# EAGLE design afb_r003 (EAGLE 9.6.2)
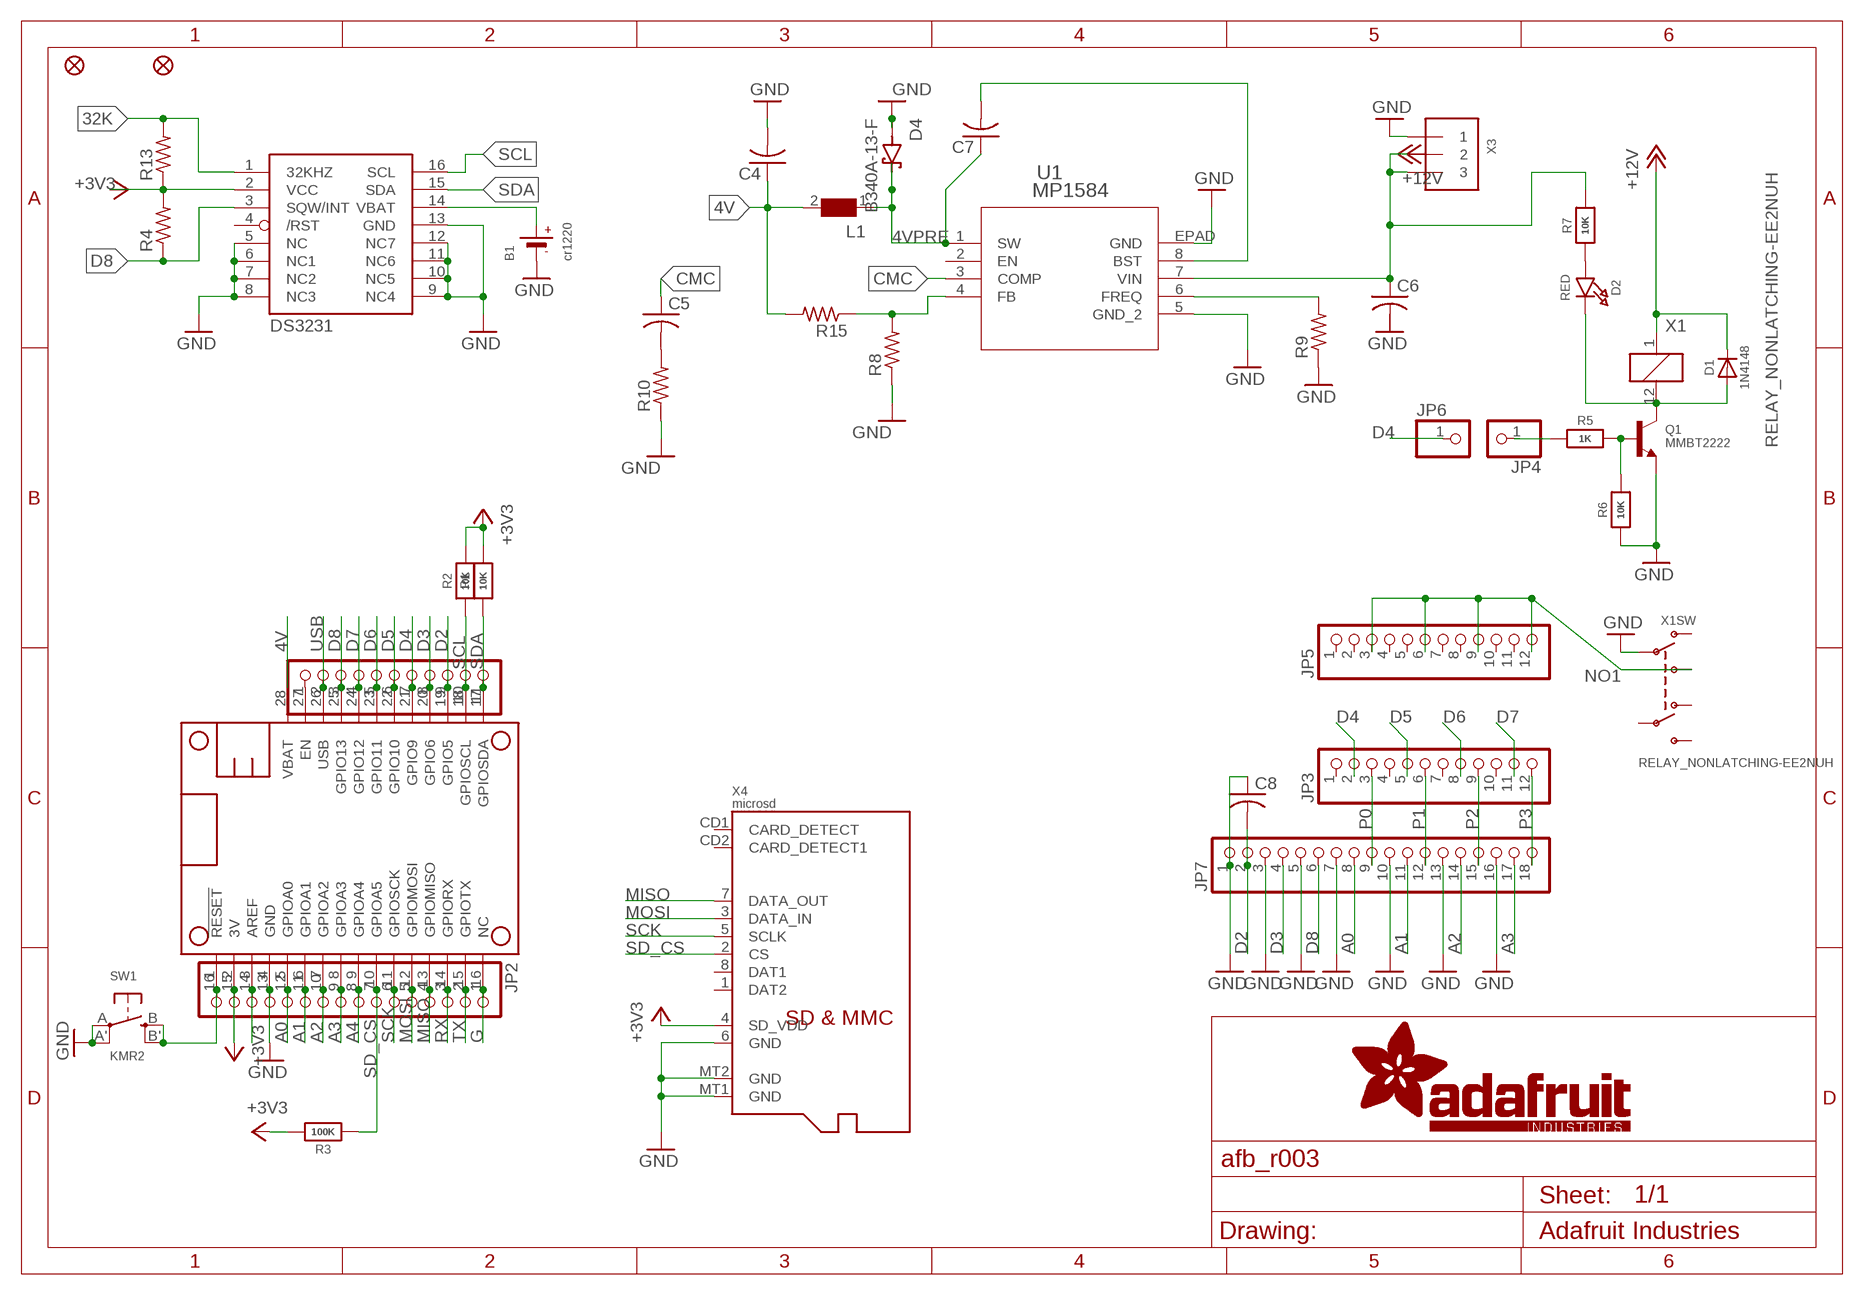
[diagram p0: schematic, sheet 1]

## Parts
B1  cr1220  BATTERYCR1220_2  [CR1220-2]
C4  C-USC0805  [C0805]
C5  C-USC0805  [C0805]
C6  C-USC0805  [C0805]
C7  C-USC0805  [C0805]
C8  C-USC0805  [C0805]
D1  1N4148  DIODESOD-323  [SOD-323]
D2  RED  LED0805_NOOUTLINE  [CHIPLED_0805_NOOUTLINE]
D4  B340A-13-F  [DIOM5226X240N]
FID1  FIDUCIAL_1MM  [FIDUCIAL_1MM]
FID2  FIDUCIAL_1MM  [FIDUCIAL_1MM]
IC2  DS3231/SO  [SO16W]
JP1  HEADER-1X11  [1X11_ROUND]
JP2  HEADER-1X16ROUND  [1X16_ROUND]
JP3  PINHD-1X12-CB  [1X12-CB]
JP4  HEADER-1X1ROUND  [1X01_ROUND]
JP5  PINHD-1X12-CB  [1X12-CB]
JP6  HEADER-1X1ROUND  [1X01_ROUND]
JP7  PINHD-1X18  [1X18]
L1  WE-PD-744771115_1260/1245/1280/1210  [WE-PD_1260/1245/1280/1210]
MS1  FEATHERWING_NODIM  [FEATHERWING_NODIM]
Q1  MMBT2222  TRANSISTOR_NPN  [SOT23-R]
R1  10K  RESISTOR_0603_NOOUT  [0603-NO]
R2  10K  RESISTOR_0603_NOOUT  [0603-NO]
R3  100K  RESISTOR_0603_NOOUT  [0603-NO]
R4  R-US_R0805  [R0805]
R5  1K  RESISTOR0805_NOOUTLINE  [0805-NO]
R6  10K  RESISTOR0805_NOOUTLINE  [0805-NO]
R7  10K  RESISTOR0805_NOOUTLINE  [0805-NO]
R8  R-US_R0805  [R0805]
R9  R-US_R0805  [R0805]
R10  R-US_R0805  [R0805]
R13  R-US_R0805  [R0805]
R15  R-US_R0805  [R0805]
SW1  KMR2  SWITCH_TACT_SMT4.6X2.8  [BTN_KMR2_4.6X2.8]
U1  MP1584  [SOIC8E_MPS]
X1  RELAY_NONLATCHING-EE2NUH  [RELAY_EE2_NOLATCH]
X3  TERMBLOCK_1X3  [TERMBLOCK_1X3-3.5MM]
X4  microsd  MICROSD  [MICROSD]

## Nets
4V: C4.1 L1.2 MS1.28(VBAT) R15.2
4VPRE: C7.1 D4.C L1.1 U1.1(SW)
32K: IC2.1(32KHZ) R13.2
+3V3: JP2.15 MS1.2(3V) R1.2 R2.2 R3.2 X4.4(SD_VDD)
+12V: D1.C X1.1
A0: JP2.12 JP7.8 MS1.5(GPIOA0)
A1: JP2.11 JP7.11 MS1.6(GPIOA1)
A2: JP2.10 JP7.14 MS1.7(GPIOA2)
A3: JP2.9 JP7.17 MS1.8(GPIOA3)
A4: JP2.8 MS1.9(GPIOA4)
AREF: JP2.14 MS1.3(AREF)
BSC: C7.2 U1.8(BST)
CMC: C5.1 U1.3(COMP)
D2: C8.2 JP1.9 JP7.2 MS1.19(GPIO5)
D3: JP1.8 JP7.4 MS1.20(GPIO6)
D4: JP1.7 JP3.2 JP6.1 MS1.21(GPIO9)
D5: JP1.6 JP3.5 MS1.22(GPIO10)
D6: JP1.5 JP3.8 MS1.23(GPIO11)
D7: JP1.4 JP3.11 MS1.24(GPIO12)
D8: IC2.2(VCC) JP1.3 JP7.6 MS1.25(GPIO13) R4.2 R13.1 ; supply symbol labelled +3V3
EN: JP1.1 MS1.27(EN)
G: JP2.1 MS1.16(NC)
GND: B1.- C4.2 C8.1 D4.A IC2.5(NC) IC2.6(NC1) IC2.7(NC2) IC2.8(NC3) IC2.9(NC4) IC2.10(NC5) IC2.11(NC6) IC2.12(NC7) IC2.13(GND) JP2.13 JP7.1 JP7.3 JP7.5 JP7.7 JP7.10 JP7.13 JP7.16 MS1.4(GND) Q1.2(E) R6.1 R8.1 R9.1 R10.1 SW1.A'(P1) SW1.A(P) U1.5(GND_2) U1.EPAD(GND) X1.9(SW:P1) X3.1 X4.6(GND) X4.MT1(GND) X4.MT2(GND)
MISO: JP2.4 MS1.13(GPIOMISO) X4.7(DATA_OUT)
MOSI: JP2.5 MS1.12(GPIOMOSI) X4.3(DATA_IN)
N$1: B1.+ IC2.14(VBAT)
N$2: D1.A D2.C Q1.3(C) X1.12
N$3: R8.2 R15.1 U1.4(FB)
N$4: C5.2 R10.2
N$5: C6.1 R7.2 U1.7(VIN) X3.2 X3.3
N$8: IC2.3(SQW/INT) R4.1
N$10: R9.2 U1.6(FREQ)
N$22: Q1.1(B) R5.2 R6.2
N$24: JP4.1 R5.1
N$26: D2.A R7.1
NO1 [HV]: JP5.3 JP5.6 JP5.9 JP5.12 X1.8(SW:S1)
P0: JP3.3 JP7.9
P1: JP3.6 JP7.12
P2: JP3.9 JP7.15
P3: JP3.12 JP7.18
RESET: JP2.16 MS1.1(!RESET) SW1.B'(S1) SW1.B(S)
RX: JP2.3 MS1.14(GPIORX)
SCK: JP2.6 MS1.11(GPIOSCK) X4.5(SCLK)
SCL: IC2.16(SCL) JP1.10 MS1.18(GPIOSCL) R2.1
SD_CS: JP2.7 MS1.10(GPIOA5) R3.1 X4.2(CS)
SDA: IC2.15(SDA) JP1.11 MS1.17(GPIOSDA) R1.1
TX: JP2.2 MS1.15(GPIOTX)
USB: JP1.2 MS1.26(USB)
Unconnected: C6.2 IC2.4(/RST) JP3.1 JP3.4 JP3.7 JP3.10 JP5.1 JP5.2 JP5.4 JP5.5 JP5.7 JP5.8 JP5.10 JP5.11 U1.2(EN) X1.3(SW:O2) X1.4(SW:P2) X1.5(SW:S2) X1.10(SW:O1) X4.1(DAT2) X4.8(DAT1) X4.CD1(CARD_DETECT) X4.CD2(CARD_DETECT1)

## Library data of the parts
B1 = microbuilder:BATTERY: CR1220 SMT - Digikey: 3001K-ND CD2032 BAT-HLD-001 - Digikey: BAT-HLD-001-ND
C4-C8 = adafruit:C-US: CAPACITOR, American symbol
D1 = microbuilder:DIODE: Diode SMA Model Volts Amps Type Vf Ir Digikey # Notes SSA34-E3 40V 3A Schottky 480mV @ 3A 200uA @ 40V SSA34-E3/61TGITR-ND CDBA120-G 20V 1A Schottky 500mV @ 1A 500uA @ 20V 641-1014-6-ND REEL MBRA210 10V 2A Schottky 350mV @ 2A 700uA @ 10V MBRA210LT3 SOD-123 Model Volts Amps Type Vf Ir Order # Notes BAT54T1G 30V 200mA Schottky 800mV @ 200mA 2uA @ 25V BAT54T1GOSTR-ND B0530W 30V 500mA Schottky 430mV @ 500mA 130uA @ 30V B0530W-FDICT-ND REEL MBR120 20V 1A Schottky 340mV @ 1A MBR120VLSFT1GOSCT-ND SOD-323 Model Volts Amps Type Vf Ir Order # Notes PMEG2005EJ 20V 500mA Schottky 355mV @ 500mA 568-4110-1-ND ZLLS410 10V 570mA Schottky 380mV @ 570mA ZLLS410CT-ND 1N4148WS 75V 150mA Silicon/Simple 1V 1N4148WSFSCT-ND REEL SOD-523 Model Volts Amps Type Vf Ir Order # Notes BAT54XV2 30V 200mA Schottky 0.8V @ 100mA BAT54XV2CT-ND TB751S 30V 30mA Schottky RB751S-40TE61CT-ND SOT23-R/W (R = Solder Paste/Reflow Ovens, W = Hand-Soldering) Model Volts Amps Type Vf Ir Order # Notes BAT54FILM 40V 300mA Schottky 497-7162-1-ND POWERDI-5 Model Volts Amps Type Vf Ir Order # Notes PDS560 60V 5A Schottky 670mV @ 5A 150uA @ 60V PDS560DICT-ND
D2 = microbuilder:LED: LED 0603 - 0603 Surface Mount Package 2mA: Green LED - Low Power (3.9mcd, 2ma, 1.7Vf) - Digikey: 475-2709-2-ND Orange LED - Low Power (9.8mcd, 2ma, 1.8Vf) - Digikey: 475-1194-2-ND Red LED - Low Power (5mcd, 2ma, 1.8Vf) - Digikey: 475-1195-2-ND Yellow LED - Low Power (7mcd, 2ma, 1.8Vf) - Digikey: 475-1196-2-ND 5mA: Blue LED - Low Power (17mcd, 5ma, 2.9Vf) - Digikey: LNJ937W8CRACT-ND 0805 - 0805 Surface Mount Package 2mA: Red LED (8.8mcd, 2mA, 1.8Vf, Clear) - Low Power [Digikey: 475-2510-1-ND] Green LED (5mcd, 2mA, 1.8Vf, Clear) - Low Power [Digikey: 475-2730-1-ND] Yellow LED (11.3mcd, 2mA, 1.8Vf, Clear) - Low Power [Digikey: 475-2555-1-ND] 20mA: Red LED (104mcd, 20mA, Diffused) - LS R976 [Digikey: 475-1278-6-ND] Red LED (12mcd, 20mA, 2.0Vf, Clear) - APT2012EC [Digikey: 754-1128-1-ND] Green LED (15mcd, 20mA, 2.2Vf, Clear) - APT2012GC [Digikey: 754-1131-1-ND] Orange LED (160mcd, 20mA, 2.1Vf, Clear) - APT2012SECK [Digikey: 754-1130-1-ND] 1206 - 1206 Surface Mount Package Green LED (26mcd, 20mA, Diffused) - LG N971 [Digikey: 475-1407-6-ND] Red LED (15mcd, 20mA, Diffused) - LH N974 [Digikey: 475-1416-6-ND] Cree - Cree High-Power Surface Mount LEDs XPEBWT-L1-0000-00D50 - White 111lm 350mA 2.9Vf 6200K 110° XTEAWT-00-0000-00000LEE3 - White 114lm 350mA 2.85Vf 5000K 115° Everlight - Everlight 45-21 Series Surface Mount LEDs 45-21/QK2C-B2832AC2CB2/2T - Warm White 2000mcd 20mA 3.25Vf 3050K 120° 45-21/LK2C-B38452C4CB2/2T - Nuetral White 2000mcd 20mA 3.25Vf 4150K 120° 45-21/LK2C-B50634C6CB2/2T - Cold White 2200mcd 20mA 3.25Vf 5650K 120° PLCC2 Reverse Mount LS T77K-J1L2-1-0-2-R18-Z - Red 11.25mcd 2mA 1.8Vf 630nm 120° LO T77K-L1M2-24-Z - Orange 19.6mcd 2mA 1.8Vf 606nm 120° LY T77K-K2M1-26-Z - Yellow 15.7mcd 2mA 1.8Vf 587nm 120°
D4 = B340A-13-F:B340A-13-F: Diode, Rectifier, 3a, 40v, Do-214ac, Full Reel; DESCRIPTION: Diode Schottky 40V 3A Surface Mount SMA; DIGI-KEY_PART_NUMBER: B340A-FDICT-ND; MF: Diodes Inc.; MP: B340A-13-F; PACKAGE: DO-214 Diodes Inc.; PURCHASE-URL: https://pricing.snapeda.com/search/part/B340A-13-F/?ref=eda
FID1 FID2 = microbuilder:FIDUCIAL: Fiducial Alignment Points Various fiducial points for machine vision alignment.; BOM: EXCLUDE
IC2 = DS3231:DS3231; AVAILABILITY: Unavailable; DESCRIPTION: Real Time Clock (RTC) IC Clock/Calendar I²C, 2-Wire Serial 16-SOIC (0.295, 7.50mm Width); MF: Maxim Integrated; MP: DS3231; PACKAGE: SOIC-16 Maxim Integrated; PRICE: None
JP1 = microbuilder:HEADER-1X11
JP2 = microbuilder:HEADER-1X16: PIN HEADER
JP3 JP5 = adafruit:PINHD-1X12: PIN HEADER
JP4 JP6 = microbuilder:HEADER-1X1: PIN HEADER
JP7 = adafruit:PINHD-1X18: PIN HEADER
L1 = WE-PD:WE-PD: SMD-Shielded Power Inductors WE-PD - Magnetically shielded version which results in a low leakage field - High storage capacity - Low self-losses - Highest possible current loading for SMD-Inducors -- Switching regulators with low operating voltages (computer, laptop, mobile phones, pagers) -- Integrated DC/DC-converter -- Is recommended for the application with switching regulators from National Semiconductor, Linear Technology, Texas Instruments and Fairchild Semiconductor, ect. -- Graphic cards -- Plastic base: Because of the one piece construction these are more suitable for high vibration or shock applications; MPN: 744771115; OC_FARNELL: 1635908; OC_NEWARK: 08P2786; PACKAGE: 1260; SUPPLIER: Wuerth Elektronik
MS1 = microbuilder:FEATHERWING
Q1 = microbuilder:TRANSISTOR_NPN: NPN Transistor Transistor (NPN) 500mA 45V - BC817 [Digikey: 568-1631-1-ND] Transistor (NPN) 500mA 45V - BC817,215 [Mouser: 771-BC817-T/R] SOT23-R - SOT23 footprint optimised for use with solder paste and reflow ovens. SOT23-W - SOT23 footprint optimised for hand-soldering (larger pads).
R1-R3 R5-R7 = microbuilder:RESISTOR: Resistors For new designs, use the packages preceded by an '_' character since they are more reliable: The following footprints should be used on most boards: _0402 - Standard footprint for regular board layouts _0603 - Standard footprint for regular board layouts _0805 - Standard footprint for regular board layouts _1206 - Standard footprint for regular board layouts For extremely tight-pitch boards where space is at a premium, the following 'micro-pitch' footprints can be used (smaller pads, no silkscreen outline, etc.): _0402MP - Micro-pitch footprint for very dense/compact boards _0603MP - Micro-pitch footprint for very dense/compact boards _0805MP - Micro-pitch footprint for very dense/compact boards _1206MP - Micro-pitch footprint for very dense/compact boards
R4 R8-R10 R13 R15 = adafruit:R-US_: RESISTOR, American symbol
SW1 = microbuilder:SWITCH_TACT_SMT: SMT Tact Switches 6x6mm - Digikey: P12940SCT-ND KMR2 (4.6x2.8mm) - Digikey: 401-1426-1-ND EVQ-PQHB55 - Light Touch, 160GF (4.5x4.5mm) - Digikey: P8090SCT-ND KMT0 - KMT021 NGJ LHS (etc.) IP68/Waterproof - Digikey: CKN10289CT-ND
U1 = MP1584:MP1584; BUILT_BY: EMA_Cory; COPYRIGHT: Copyright (C) 2018 Accelerated Designs. All rights reserved; DATASHEET: https://www.monolithicpower.com/en/documentview/productdocument/index/version/2/document_type/Datasheet/lang/en/sku/MP1584/document_id/204; MANUFACTURER_PART_NUMBER: MP1584; SOURCELIBRARY: MPS_2020-01-27; VENDOR: Monolithic Power Systems Inc
X1 = microbuilder:RELAY_NONLATCHING
X3 = microbuilder:TERMBLOCK_1X3: 3.5mm Terminal block http://www.ladyada.net/library/pcb/eaglelibrary.html
X4 = microbuilder:MICROSD: MicroSD/Transflash Card Holder with SPI pinout 3M: 2908-05WB-MG 4UConnector: 19656 Footprint courtesy: Adafruit Industries

## Net classes
1 HV: width 0.406 mm, drill 0.381 mm, clearance 1.016 mm

## Board
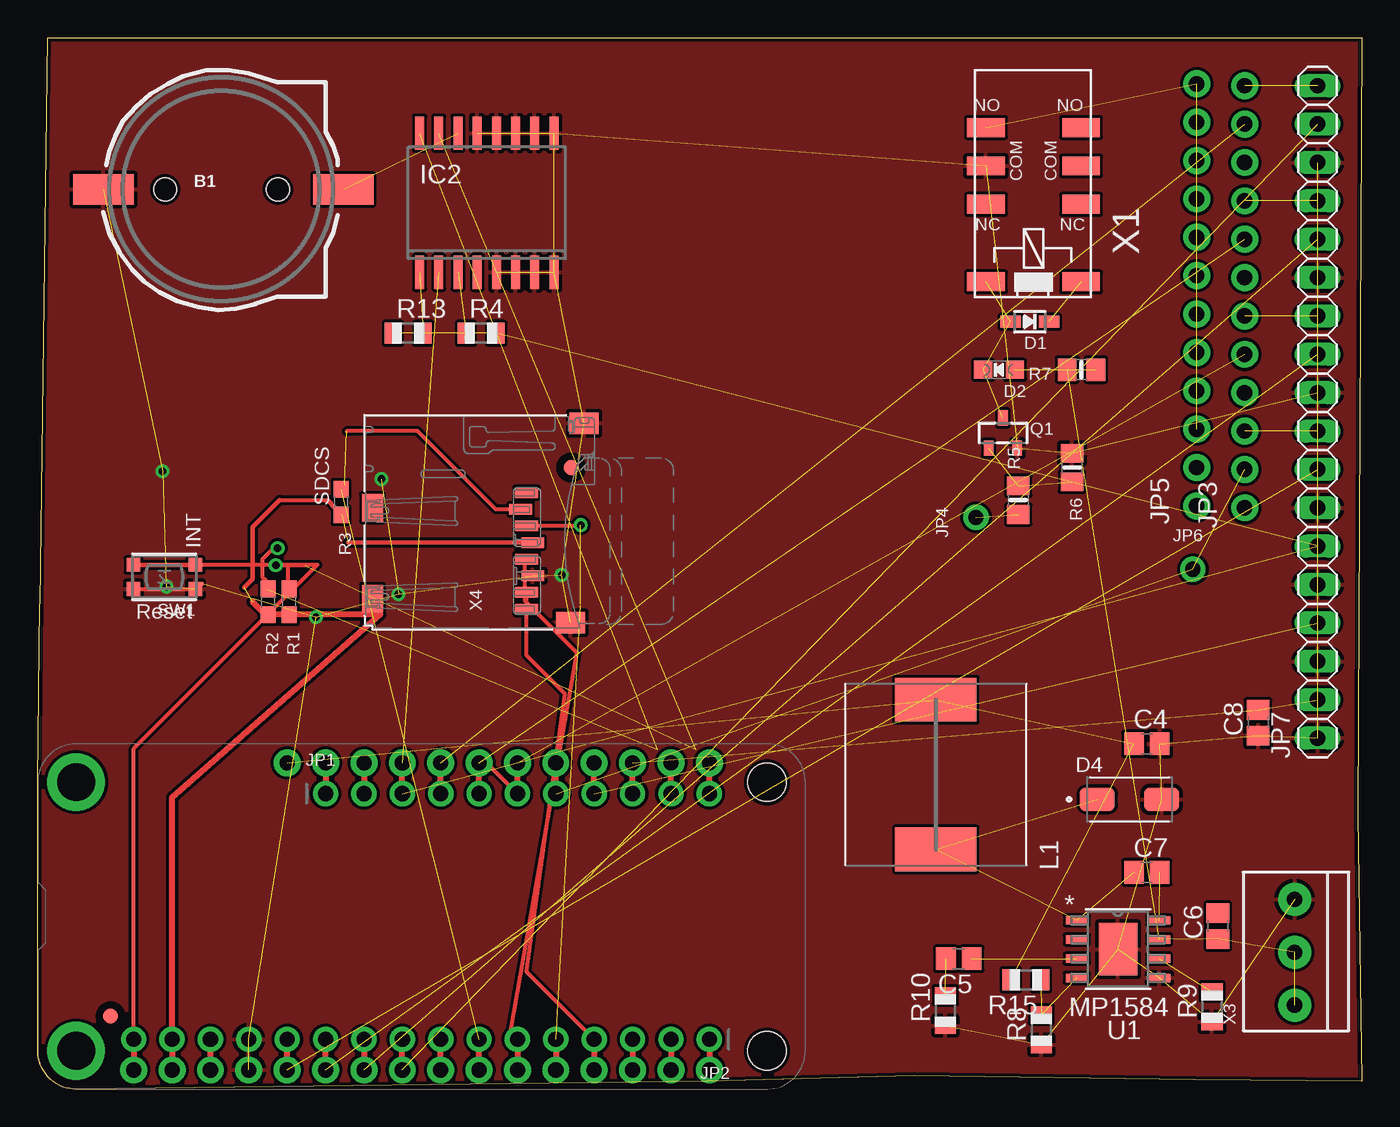
[diagram p1: board, top side]
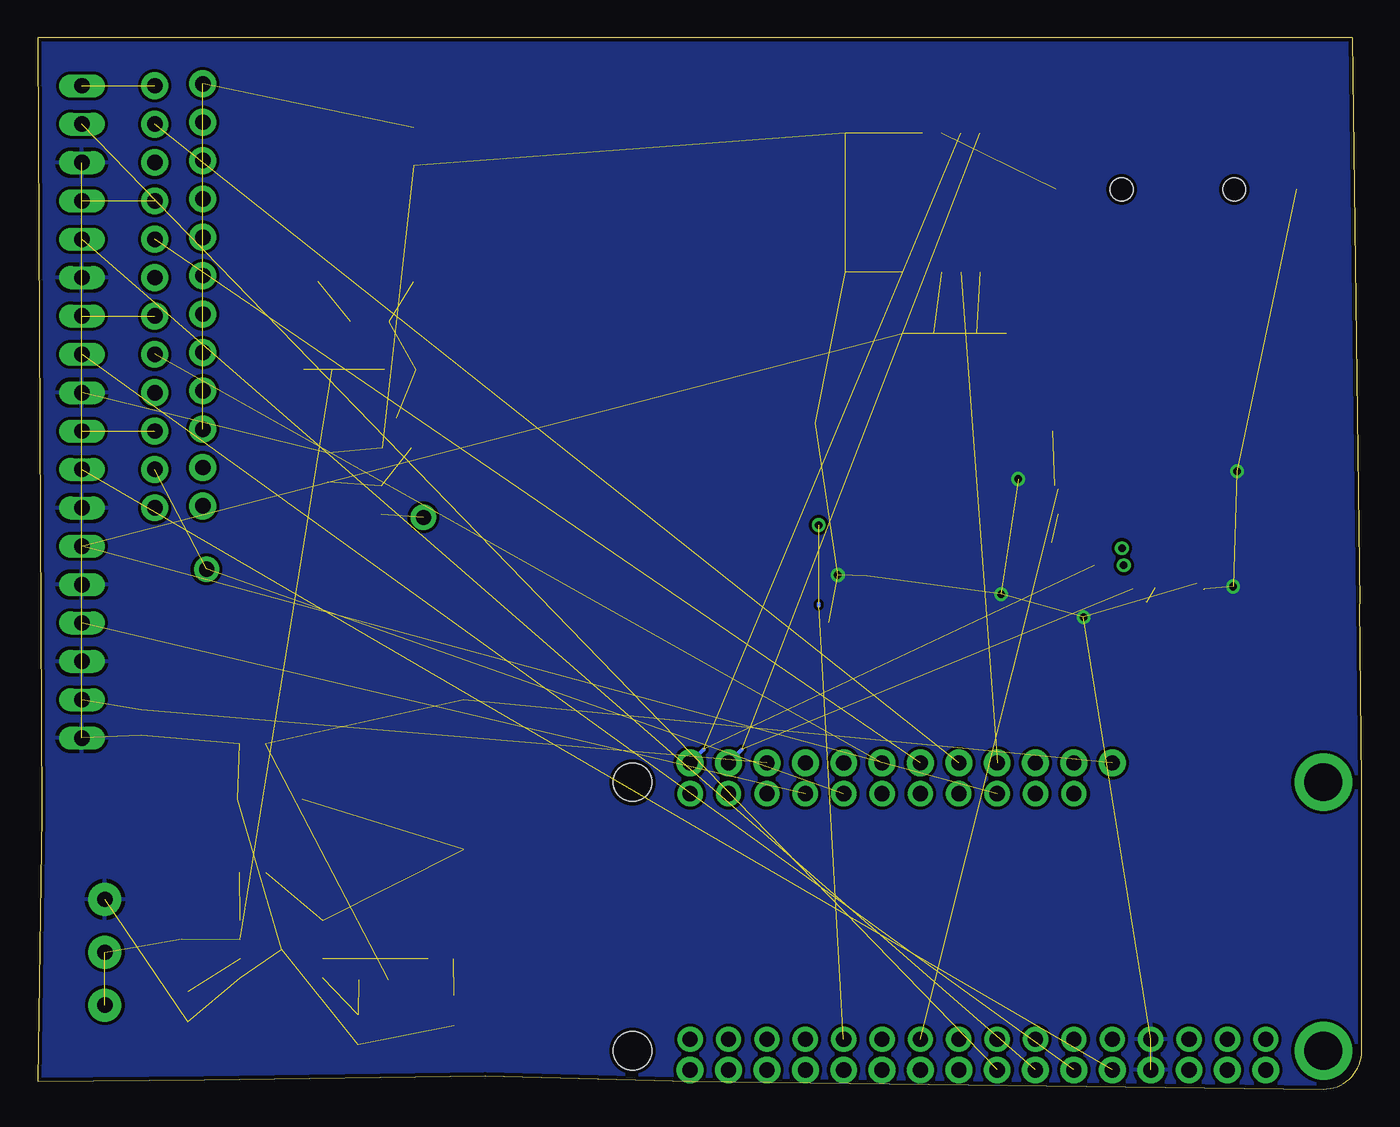
[diagram p2: board, bottom side, seen from below]

Size 87.63 x 69.6 mm. Coordinates in mm from the lower left corner, seen from the top.
Outline: 0.64,69.6 87.63,69.6 87.38,18.16 87.63,0.51 76.58,0.64 58.04,0.89 44.32,0.51 2.54,0 arc-90 0,2.54 0,20.32 0.13,32.13 0.64,69.6
Copper layers (1*16): Top 0.035mm / dielectric 1.5mm / Bottom 0.035mm
Design rules "adafruit *": minimum track width 8mil, minimum drill 15.5mil, track to track 8mil, track to pad 8mil, pad to pad 8mil, via to via 8mil, smd to smd 8mil, copper to edge 10mil, drill to drill 8mil, minimum pad ring 10mil, minimum via ring 8mil, stop-mask expansion 2mil, vias tented up to drill 20mil, thermal gap 10mil

### Footprints (pad centres in the part's own frame; a part is rotated, then mirrored left to right if it is on the bottom)
CR1220-2 = smd 4 x 2: + 8.29,0; - -7.6,0 | hole 1.5: 3.95,0; -3.5,0
C0805 = smd 1.3 x 1.5: 1 -0.85,0; 2 0.85,0
SOD-323 = smd 1.35 x 0.8: A 1.27,0; C -1.27,0
CHIPLED_0805_NOOUTLINE = smd 1.2 x 1.2: A 0,-1.05; C 0,1.05
DIOM5226X240N = smd 2.33 x 1.55: A 2.135,0; C -2.135,0
FIDUCIAL_1MM = smd 1 x 1: 1 0,0
SO16W = smd 0.6 x 2.2: 1 -4.445,-4.6; 2 -3.175,-4.6; 3 -1.905,-4.6; 4 -0.635,-4.6; 5 0.635,-4.6; 6 1.905,-4.6; 7 3.175,-4.6; 8 4.445,-4.6; 9 4.445,4.6; 10 3.175,4.6; 11 1.905,4.6; 12 0.635,4.6; 13 -0.635,4.6; 14 -1.905,4.6; 15 -3.175,4.6; 16 -4.445,4.6
1X11_ROUND = drill 1 pad 1.676: 1 -12.7,0; 2 -10.16,0; 3 -7.62,0; 4 -5.08,0; 5 -2.54,0; 6 0,0; 7 2.54,0; 8 5.08,0; 9 7.62,0; 10 10.16,0; 11 12.7,0
1X16_ROUND = drill 1 pad 1.676: 1 -19.05,0; 2 -16.51,0; 3 -13.97,0; 4 -11.43,0; 5 -8.89,0; 6 -6.35,0; 7 -3.81,0; 8 -1.27,0; 9 1.27,0; 10 3.81,0; 11 6.35,0; 12 8.89,0; 13 11.43,0; 14 13.97,0; 15 16.51,0; 16 19.05,0
1X12-CB = drill 1.016 pad 1.778: 1 -13.97,0; 2 -11.43,0; 3 -8.89,0; 4 -6.35,0; 5 -3.81,0; 6 -1.27,0; 7 1.27,0; 8 3.81,0; 9 6.35,0; 10 8.89,0; 11 11.43,0; 12 13.97,0
1X01_ROUND = drill 1 pad 1.676: 1 0,0
1X18 = drill 1.016 long: 1 -21.59,0; 2 -19.05,0; 3 -16.51,0; 4 -13.97,0; 5 -11.43,0; 6 -8.89,0; 7 -6.35,0; 8 -3.81,0; 9 -1.27,0; 10 1.27,0; 11 3.81,0; 12 6.35,0; 13 8.89,0; 14 11.43,0; 15 13.97,0; 16 16.51,0; 17 19.05,0; 18 21.59,0
WE-PD_1260/1245/1280/1210 = smd 2.9 x 5.4: 1 -4.95,0; 2 4.95,0
FEATHERWING_NODIM = drill 1 pad 1.778: 1 6.35,1.27; 2 8.89,1.27; 3 11.43,1.27; 4 13.97,1.27; 5 16.51,1.27; 6 19.05,1.27; 7 21.59,1.27; 8 24.13,1.27; 9 26.67,1.27; 10 29.21,1.27; 11 31.75,1.27; 12 34.29,1.27; 13 36.83,1.27; 14 39.37,1.27; 15 41.91,1.27; 16 44.45,1.27; 17 44.45,21.59; 18 41.91,21.59; 19 39.37,21.59; 20 36.83,21.59; 21 34.29,21.59; 22 31.75,21.59; 23 29.21,21.59; 24 26.67,21.59; 25 24.13,21.59; 26 21.59,21.59; 27 19.05,21.59; 28 16.51,21.59 | drill 2.5 pad 3.81: P$1 2.54,20.32; P$2 2.54,2.54 | hole 2.54: 48.26,20.32; 48.26,2.54
SOT23-R = smd 0.635 x 1.016: 1 -0.95,-1; 2 0.95,-1; 3 0,1
0603-NO = smd 1.1 x 1: 1 -0.85,0; 2 0.85,0
R0805 = smd 1.1 x 1.4: 1 -1,0; 2 1,0
0805-NO = smd 1.24 x 1.5: 1 -0.95,0; 2 0.95,0
BTN_KMR2_4.6X2.8 = smd 0.9 x 0.9: A 2.05,0.8; A' -2.05,0.8; B 2.05,-0.8; B' -2.05,-0.8
SOIC8E_MPS = smd 1.46 x 0.559: 1 -2.724,1.905; 2 -2.724,0.635; 3 -2.724,-0.635; 4 -2.724,-1.905; 5 2.724,-1.905; 6 2.724,-0.635; 7 2.724,0.635; 8 2.724,1.905 | smd 2.565 x 3.454: EPAD 0,0
RELAY_EE2_NOLATCH = smd 1.25 x 2.5: 1 -6.5,-3.15; 3 -1.37,-3.15; 4 1.17,-3.15; 5 3.71,-3.15; 8 3.71,3.15; 9 1.17,3.15; 10 -1.37,3.15; 12 -6.5,3.15
TERMBLOCK_1X3-3.5MM = drill 1 pad 2.184: 1 3.55,0; 2 0.05,0; 3 -3.45,0
MICROSD = smd 0.7 x 1.5: 1 9,-10.64; 2 7.9,-10.24; 3 6.8,-10.64; 4 5.7,-11.04; 5 4.6,-10.64; 6 3.5,-11.04; 7 2.4,-10.64; 8 1.3,-10.64 | smd 1.8 x 1.4: CD1 2,-0.44; CD2 8,-0.44 | smd 1.4 x 1.9: MT1 0.4,-13.54; MT2 13.6,-14.44

### Placement (x,y rotation side)
B1  11.94,59.56 0 top
C4  73.41,22.86 0 top
C5  60.96,8.64 180 top
C6  78.11,10.79 90 top
C7  73.41,14.35 0 top
C8  80.77,24.26 90 top
D1  65.66,50.8 180 top
D2  63.63,47.62 90 top
D4  72.26,19.18 0 top
FID1  35.31,41.15 0 top
FID2  4.83,4.83 0 top
IC2  29.72,58.67 0 top
JP1  31.75,19.56 0 top
JP2  25.4,3.3 180 top
JP3  79.88,52.45 90 top
JP4  62.1,37.85 90 top
JP5  76.71,52.58 90 top
JP6  76.45,34.42 0 top
JP7  84.71,44.83 90 top
L1  59.44,20.83 90 top
MS1  0,0 0 top
Q1  63.88,43.43 0 top
R1  16.64,32.26 270 top
R2  15.24,32.26 270 top
R3  20.07,38.86 270 top
R4  29.34,50.04 0 top
R5  64.9,38.99 90 top
R6  68.45,41.15 270 top
R7  69.09,47.62 180 top
R8  66.42,3.94 90 top
R9  77.72,5.46 90 top
R10  60.07,5.21 90 top
R13  24.51,50.04 0 top
R15  65.41,7.24 180 top
SW1  8.38,33.91 180 top
U1  71.5,9.27 0 top
U$4  [ADAFRUIT_3.5MM]  -17.02,12.57 0 top  (outside the outline)
U$5  [PCBFEAT-REV-040]  -17.53,9.65 0 top  (outside the outline)
X1  65.91,59.94 90 top
X3  83.19,9.02 90 top
X4  21.72,30.48 90 top

### Tracks (layer width: path | path; a pad name or v marks a point on that pad's centre or on a via)
4V  (3 unrouted)
4VPRE  (3 unrouted)
32K  (1 unrouted)
+3V3  (3 unrouted)
  Top 0.254: 15.21,31.38 14.79,31.77 14.28,32.27 | R2.2 R1.2 | 16,38.99 19.18,38.99 | 19.68,38.48 19.71,38.47
  Top 0.305: 16,38.99 14.22,37.21 14.22,33.78 13.65,33.21 | 19.18,38.99 19.68,38.48 | 19.71,38.47 20.11,38.06 | 20.55,36.18 X4.4
  Top 0.406: MS1.2 JP2.15 8.89,19.3 22.67,31.43 15.05,31.43 14.22,32.26
+12V  (1 unrouted)
A0  (1 unrouted)
  Top 0.406: MS1.5 JP2.12
A1  (1 unrouted)
  Top 0.406: MS1.6 JP2.11
A2  (1 unrouted)
  Top 0.406: JP2.10 MS1.7
A3  (1 unrouted)
  Top 0.406: MS1.8 JP2.9
A4
  Top 0.406: MS1.9 JP2.8
AREF
  Top 0.406: MS1.3 JP2.14
BSC  (1 unrouted)
CMC  (1 unrouted)
D2  (2 unrouted)
  Top 0.406: JP1.9 MS1.19
D3  (1 unrouted)
  Top 0.406: JP1.8 MS1.20
D4  (2 unrouted)
  Top 0.406: JP1.7 MS1.21
D5  (1 unrouted)
  Top 0.254: JP1.6 29.97,21.34
  Top 0.406: JP1.6 MS1.22
D6  (1 unrouted)
  Top 0.406: JP1.5 MS1.23
D7  (1 unrouted)
  Top 0.406: JP1.4 MS1.24
D8  (4 unrouted)
  Top 0.406: JP1.3 MS1.25
EN
  Top 0.406: MS1.27 JP1.1
G
  Top 0.406: JP2.1 MS1.16
GND  (via drill 0.5)  (41 unrouted)
  Top 0.254: SW1.A SW1.A' | 10.49,33.05 10.91,33.47
  other vias: 8.26,40.89 34.67,34.04 22.73,40.39 8.51,33.27 23.88,32.77 18.41,31.24
  pour Top: 0,70.1 0,0 88.01,0 88.01,70.1
  pour Bottom: 0,69.98 0,0 88.14,0 88.14,69.98
MISO
  Top 0.254: X4.7 32.36,28.7 34.88,26.18 32.36,7.78 JP2.4
  Top 0.406: JP2.4 MS1.13
MOSI  (via drill 0.5)  (2 unrouted)
  Top 0.254: v35.94,37.34 35.88,37.28 X4.3
  Top 0.406: JP2.5 MS1.12
  Bottom 0.254: 35.94,32 35.94,32.13
N$1  (1 unrouted)
N$2  (3 unrouted)
N$3  (2 unrouted)
N$4  (1 unrouted)
N$5  (4 unrouted)
N$8  (1 unrouted)
N$10  (1 unrouted)
N$22  (2 unrouted)
N$24  (1 unrouted)
N$26  (1 unrouted)
NO1  (4 unrouted)
P0  (1 unrouted)
P1  (1 unrouted)
P2  (1 unrouted)
P3  (1 unrouted)
RESET
  Top 0.254: SW1.B' SW1.B 18.5,34.71 6.35,22.55 JP2.16
  Top 0.406: JP2.16 MS1.1
RX
  Top 0.406: JP2.3 MS1.14
SCK
  Top 0.254: JP2.6 31.28,3.77 35.69,28.88 32.26,32.31 32.26,34.98 X4.5
  Top 0.406: JP2.6 MS1.11
SCL  (via drill 0.5)  (2 unrouted)
  Top 0.254: v15.88,35.81 15.62,35.81 14.86,35.05 14.86,33.91 15.11,33.66 15.14,33.11
  Top 0.406: JP1.10 MS1.18
  Bottom 0.254: 41.02,22.48 MS1.18
SD_CS  (2 unrouted)
  Top 0.254: X4.2 30.33,38.38 25.15,43.56 20.45,43.56 | R3.1 20.32,39.97
  Top 0.406: MS1.10 JP2.7
SDA  (via drill 0.5)  (2 unrouted)
  Top 0.254: 17.71,34.67 v15.75,34.67 | 16.57,33.11 16.57,34.67
  Top 0.406: JP1.11 MS1.17
  Bottom 0.254: 43.56,22.48 MS1.17
TX
  Top 0.406: JP2.2 MS1.15
USB
  Top 0.406: MS1.26 JP1.2

### Text on the board
tPlace: SDCS | INT | Reset | Adalogger